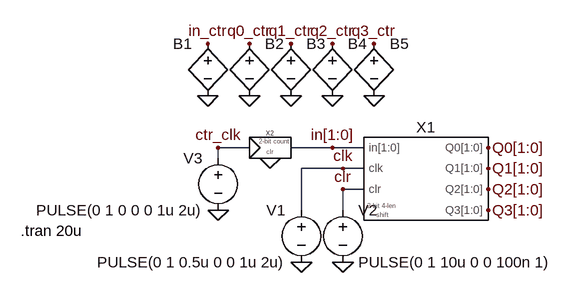
[diagram p0: schematic test-shift_reg-2bit-4len-full.asc]
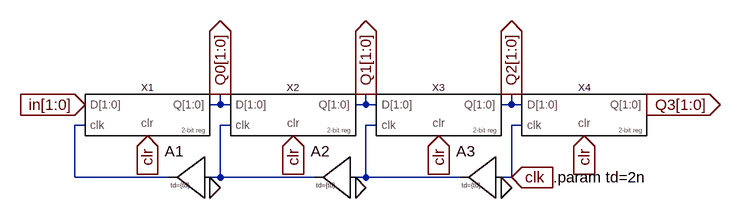
[diagram p1: sub-circuit shift_reg-2bit-4len.asc]
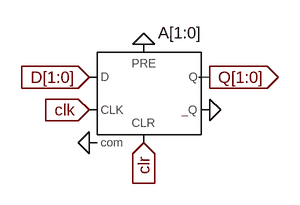
[diagram p2: sub-circuit dbuf_2bit.asc]
test-shift_reg-2bit-4len-full.asc, the LTspice schematic file:
Version 4
SHEET 1 880 680
WIRE -64 160 -112 160
WIRE 64 160 0 160
WIRE 112 160 64 160
WIRE -112 176 -112 160
WIRE 80 192 16 192
WIRE 112 192 80 192
WIRE 112 224 80 224
WIRE 16 256 16 192
WIRE 80 256 80 224
FLAG 304 160 Q0[1:0]
FLAG 64 160 in[1:0]
FLAG -32 176 0
FLAG -112 256 0
FLAG 80 336 0
FLAG 16 336 0
FLAG 80 224 clr
FLAG 80 192 clk
FLAG -112 160 ctr_clk
FLAG -64 80 0
FLAG -128 80 0
FLAG -128 0 in_ctr
FLAG -64 0 q0_ctr
FLAG 304 192 Q1[1:0]
FLAG 304 224 Q2[1:0]
FLAG 0 80 0
FLAG 0 0 q1_ctr
FLAG 64 80 0
FLAG 64 0 q2_ctr
FLAG 304 256 Q3[1:0]
FLAG 128 80 0
FLAG 128 0 q3_ctr
SYMBOL up_2bitcounter -32 160 R0
SYMATTR InstName X2
SYMBOL voltage 16 240 M0
WINDOW 123 0 0 Left 0
WINDOW 39 0 0 Left 0
SYMATTR InstName V1
SYMATTR Value PULSE(0 1 0.5u 0 0 1u 2u)
SYMBOL voltage 80 240 R0
WINDOW 123 0 0 Left 0
WINDOW 39 0 0 Left 0
SYMATTR InstName V2
SYMATTR Value PULSE(0 1 10u 0 0 100n 1)
SYMBOL voltage -112 160 M0
WINDOW 123 0 0 Left 0
WINDOW 39 0 0 Left 0
SYMATTR InstName V3
SYMATTR Value PULSE(0 1 0 0 0 1u 2u)
SYMBOL bv -128 -16 M0
WINDOW 3 24 96 Invisible 2
SYMATTR Value V=V(in[0])+2*V(in[1])
SYMATTR InstName B1
SYMBOL bv -64 -16 R0
WINDOW 3 24 96 Invisible 2
SYMATTR Value V=V(Q0[0])+2*V(Q0[1])
SYMATTR InstName B2
SYMBOL bv 0 -16 R0
WINDOW 3 24 96 Invisible 2
SYMATTR Value V=V(Q1[0])+2*V(Q1[1])
SYMATTR InstName B3
SYMBOL bv 64 -16 R0
WINDOW 3 24 96 Invisible 2
SYMATTR Value V=V(Q2[0])+2*V(Q2[1])
SYMATTR InstName B4
SYMBOL shift_reg-2bit-4len 208 208 R0
SYMATTR InstName X1
SYMBOL bv 128 -16 R0
WINDOW 3 24 96 Invisible 2
SYMATTR Value V=V(Q3[0])+2*V(Q3[1])
SYMATTR InstName B5
TEXT -416 288 Left 2 !.tran 20u

shift_reg-2bit-4len.asc, the sub-circuit schematic file:
Version 4
SHEET 1 1316 680
WIRE 256 96 256 80
WIRE 256 96 240 96
WIRE 272 96 256 96
WIRE 480 96 480 80
WIRE 480 96 464 96
WIRE 496 96 480 96
WIRE 704 96 704 80
WIRE 704 96 688 96
WIRE 720 96 704 96
WIRE 48 128 32 128
WIRE 272 128 256 128
WIRE 496 128 480 128
WIRE 720 128 704 128
WIRE 32 208 32 128
WIRE 176 208 32 208
WIRE 256 208 256 128
WIRE 256 208 240 208
WIRE 400 208 256 208
WIRE 480 208 480 128
WIRE 480 208 464 208
WIRE 624 208 480 208
WIRE 704 208 704 128
WIRE 704 208 688 208
FLAG 144 144 clr
IOPIN 144 144 In
FLAG 368 144 clr
IOPIN 368 144 In
FLAG 592 144 clr
IOPIN 592 144 In
FLAG 240 224 0
FLAG 464 224 0
FLAG 48 96 in[1:0]
IOPIN 48 96 In
FLAG 256 80 Q0[1:0]
IOPIN 256 80 Out
FLAG 480 80 Q1[1:0]
IOPIN 480 80 Out
FLAG 816 144 clr
IOPIN 816 144 In
FLAG 704 208 clk
IOPIN 704 208 In
FLAG 688 224 0
FLAG 912 96 Q3[1:0]
IOPIN 912 96 Out
FLAG 704 80 Q2[1:0]
IOPIN 704 80 Out
SYMBOL Digital\\buf1 240 144 M0
WINDOW 3 31 76 Left 0
SYMATTR Value td={td}
SYMATTR InstName A1
SYMBOL dbuf_2bit 144 112 R0
SYMATTR InstName X1
SYMBOL dbuf_2bit 368 112 R0
SYMATTR InstName X2
SYMBOL dbuf_2bit 592 112 R0
SYMATTR InstName X3
SYMBOL dbuf_2bit 816 112 R0
SYMATTR InstName X4
SYMBOL Digital\\buf1 464 144 M0
WINDOW 3 31 76 Left 0
SYMATTR Value td={td}
SYMATTR InstName A2
SYMBOL Digital\\buf1 688 144 M0
WINDOW 3 31 76 Left 0
SYMATTR Value td={td}
SYMATTR InstName A3
TEXT 768 208 Left 2 !.param td=2n

dbuf_2bit.asc, the sub-circuit schematic file:
Version 4
SHEET 1 880 680
WIRE 224 128 208 128
FLAG 48 224 0
FLAG 224 128 Q[1:0]
IOPIN 224 128 Out
FLAG 128 224 clr
IOPIN 128 224 In
FLAG 48 128 D[1:0]
IOPIN 48 128 In
FLAG 48 176 clk
IOPIN 48 176 In
FLAG 224 176 0
FLAG 128 80 0
SYMBOL Digital\\dflop 128 80 R0
WINDOW 0 21 -17 Left 2
SYMATTR InstName A[1:0]

The netlist it stands for:
* test-shift_reg-2bit-4len-full.asc
XX2 ctr_clk 0 in[1] in[0] up_2bitcounter  ; pins clk clr Q[1:0]
V1 clk 0 PULSE(0 1 0.5u 0 0 1u 2u)
V2 clr 0 PULSE(0 1 10u 0 0 100n 1)
V3 ctr_clk 0 PULSE(0 1 0 0 0 1u 2u)
B1 in_ctr 0 V=V(in[0])+2*V(in[1])
B2 q0_ctr 0 V=V(Q0[0])+2*V(Q0[1])
B3 q1_ctr 0 V=V(Q1[0])+2*V(Q1[1])
B4 q2_ctr 0 V=V(Q2[0])+2*V(Q2[1])
XX1 clk clr in[1] in[0] Q0[1] Q0[0] Q1[1] Q1[0] Q2[1] Q2[0] Q3[1] Q3[0] shift_reg-2bit-4len
B5 q3_ctr 0 V=V(Q3[0])+2*V(Q3[1])

* block symbol definitions
.subckt shift_reg-2bit-4len clk clr in[1] in[0] Q0[1] Q0[0] Q1[1] Q1[0] Q2[1] Q2[0] Q3[1] Q3[0]
A1 N002 0 0 0 0 0 N001 0 BUF td={td}
XX1 N001 clr in[1] in[0] Q0[1] Q0[0] dbuf_2bit
XX2 N002 clr Q0[1] Q0[0] Q1[1] Q1[0] dbuf_2bit
XX3 N003 clr Q1[1] Q1[0] Q2[1] Q2[0] dbuf_2bit
XX4 clk clr Q2[1] Q2[0] Q3[1] Q3[0] dbuf_2bit
A2 N003 0 0 0 0 0 N002 0 BUF td={td}
A3 clk 0 0 0 0 0 N003 0 BUF td={td}
.param td=2n
.ends shift_reg-2bit-4len

.subckt dbuf_2bit clk clr D[1] D[0] Q[1] Q[0]
A[1:0] D[1:0] 0 clk 0 clr 0 Q[1:0] 0 DFLOP
.ends dbuf_2bit

.tran 20u
.backanno
.end